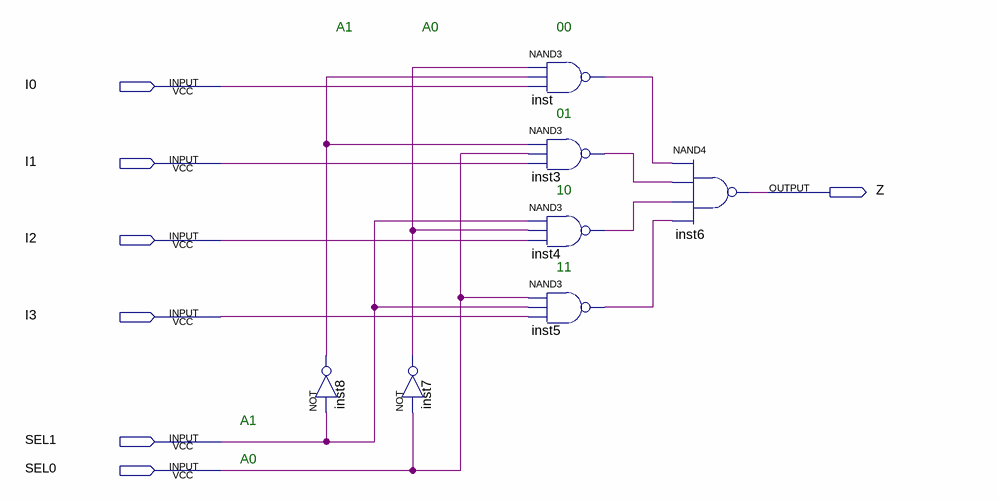
[diagram p0: schematic sheet]
// Quartus schematic 4to1mux.bdf as structural Verilog: 7 symbols, 7 pins
module \4to1mux  (
  input  I0,
  input  I1,
  input  I2,
  input  I3,
  input  SEL1,
  input  SEL0,
  output Z
);

  wire inst3_out, inst4_out, inst5_out, inst7_out, inst8_out, inst_out;

  not inst8 (inst8_out, SEL1);
  not inst7 (inst7_out, SEL0);
  nand inst (inst_out, inst7_out, inst8_out, I0);
  nand inst3 (inst3_out, inst8_out, SEL0, I1);
  nand inst4 (inst4_out, SEL1, inst7_out, I2);
  nand inst5 (inst5_out, SEL0, SEL1, I3);
  nand inst6 (Z, inst_out, inst3_out, inst4_out, inst5_out);

  // Notes on the sheet:
  //   A1
  //   A0
  //   00
  //   01
  //   10
  //   11
  //   A1
  //   A0
endmodule
